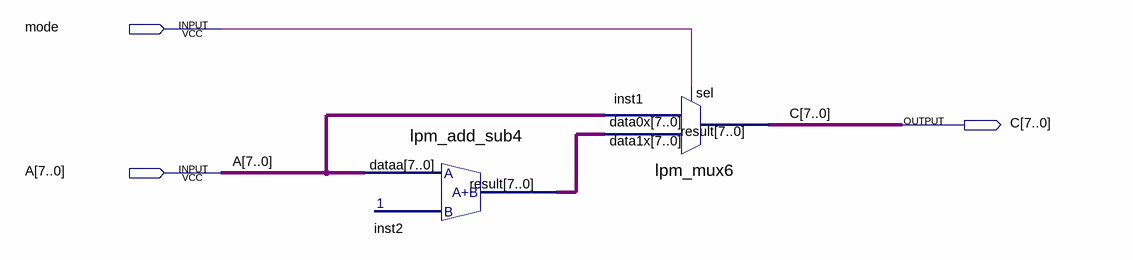
[diagram p0: schematic sheet]
// Quartus schematic ALU_ADR.bdf as structural Verilog: 2 symbols, 3 pins
module ALU_ADR (
  input  mode,
  input  [7:0] A,
  output [7:0] C
);

  wire [7:0] inst2_result;

  lpm_add_sub4 inst2 (.dataa(A), .result(inst2_result));
  lpm_mux6 inst1 (.data1x(inst2_result), .data0x(A), .sel(mode), .result(C));
endmodule
